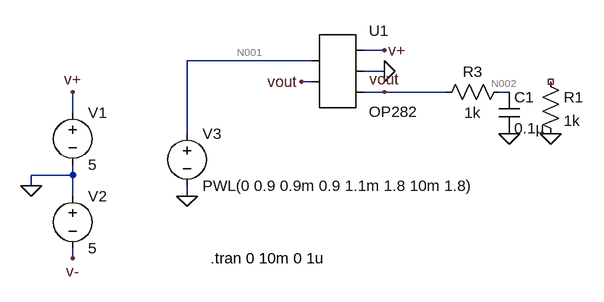
[diagram p0: schematic p1.asc]
* p1.asc
V1 v+ 0 5
V2 0 v- 5
V3 N001 0 PWL(0 0.9 0.9m 0.9 1.1m 1.8 10m 1.8)
* U1: OP282 (symbol AutoGenerated\OP282 not available, pins judged from their places): pin1=N001 pin2=vout pin3=v+ pin4=0 pin5=vout
R1 NC_01 0 1k
C1 N002 0 0.1µ
R3 N002 vout 1k
.tran 0 10m 0 1u
.backanno
.end

* Results of the author's LTspice run, read from the files saved beside the schematic
* Operating Point, zero values left out:
*   V(v+) = 5 V
*   V(v-) = -5 V
*   V(n001) = 900 mV
*   V(vout) = 901.8 mV
*   V(n002) = 901.8 mV
*   I(V3) = -7.855 pA
*   I(V1) = -206.2 µA
*   Ix(u1:1) = 7.855 pA
*   Ix(u1:2) = 6.862 pA
*   Ix(u1:99) = 206.2 µA
*   Ix(u1:50) = -206.2 µA
*   Ix(u1:30) = -6.994 pA
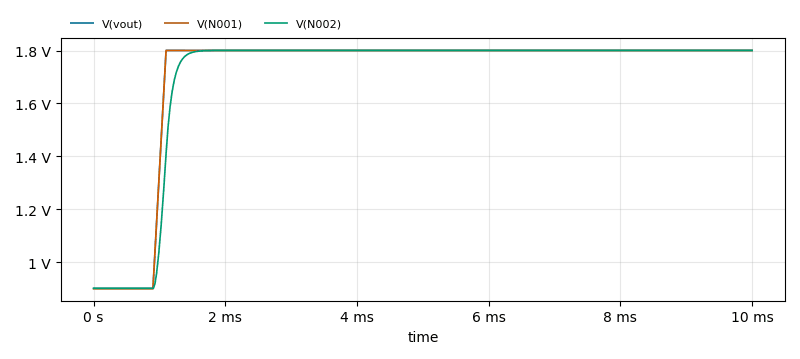
[diagram p1: Transient Analysis of p1.asc, plotted from the saved traces]
* Transient Analysis, 1 run:
*   V(vout): min 901.8 mV, max 1.801 V, average 1.71 V, rms 1.731 V, last 1.8 V
*   V(N001): min 900 mV, max 1.8 V, average 1.71 V, rms 1.73 V, last 1.8 V
*   V(N002): min 901.8 mV, max 1.8 V, average 1.701 V, rms 1.723 V, last 1.8 V